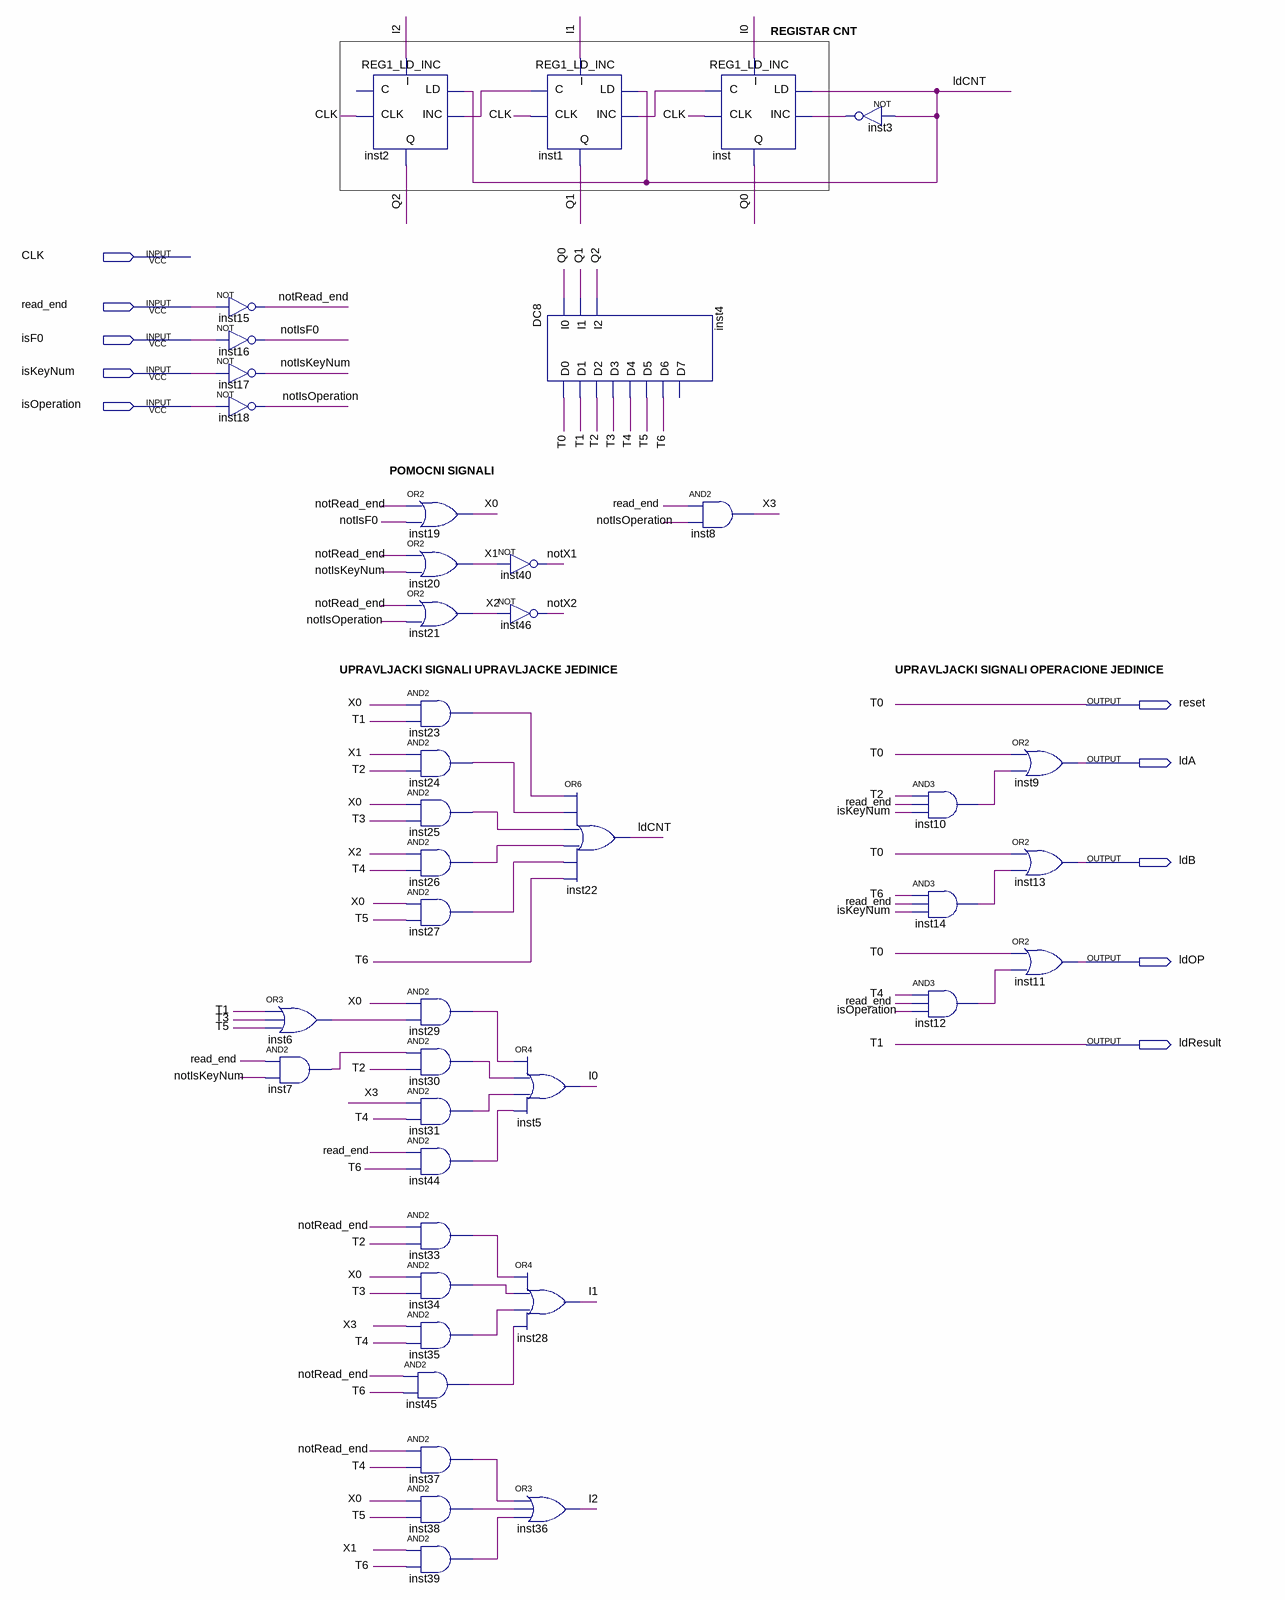
[diagram p0: schematic sheet]
// Quartus schematic UpravljackaJedinica_BrojacKoraka.bdf as structural Verilog: 43 symbols, 10 pins
module UpravljackaJedinica_BrojacKoraka (
  input  CLK,
  input  read_end,
  input  isF0,
  input  isKeyNum,
  input  isOperation,
  output reset,
  output ldA,
  output ldB,
  output ldOP,
  output ldResult
);

  wire I0, I1, I2, inst1_c, inst3_out, inst6_out, inst7_out, inst10_out, inst12_out, inst14_out, inst23_out,
       inst24_out, inst25_out, inst26_out, inst27_out, inst29_out, inst30_out, inst31_out, inst33_out,
       inst34_out, inst35_out, inst37_out, inst38_out, inst39_out, inst44_out, inst45_out, inst_c, ldCNT,
       notIsF0, notIsKeyNum, notIsOperation, notRead_end, notX1, notX2, Q0, Q1, Q2, T2, T3, T4, T5, T6, X0,
       X1, X2, X3;

  not inst15 (notRead_end, read_end);
  not inst16 (notIsF0, isF0);
  not inst17 (notIsKeyNum, isKeyNum);
  not inst18 (notIsOperation, isOperation);
  or inst6 (inst6_out, ldResult, T3, T5);
  and inst7 (inst7_out, read_end, notIsKeyNum);
  REG1_LD_INC inst2 (.I(I2), .LD(ldCNT), .INC(inst1_c), .CLK(CLK), .Q(Q2));  // open: C
  and inst45 (inst45_out, notRead_end, T6);
  or inst19 (X0, notRead_end, notIsF0);
  or inst20 (X1, notRead_end, notIsKeyNum);
  or inst21 (X2, notRead_end, notIsOperation);
  and inst23 (inst23_out, X0, ldResult);
  and inst24 (inst24_out, X1, T2);
  and inst25 (inst25_out, X0, T3);
  and inst26 (inst26_out, X2, T4);
  and inst27 (inst27_out, X0, T5);
  and inst29 (inst29_out, X0, inst6_out);
  and inst30 (inst30_out, inst7_out, T2);
  and inst31 (inst31_out, X3, T4);
  and inst44 (inst44_out, read_end, T6);
  and inst33 (inst33_out, notRead_end, T2);
  and inst34 (inst34_out, X0, T3);
  and inst35 (inst35_out, X3, T4);
  and inst37 (inst37_out, notRead_end, T4);
  and inst38 (inst38_out, X0, T5);
  and inst39 (inst39_out, X1, T6);
  REG1_LD_INC inst1 (.I(I1), .LD(ldCNT), .INC(inst_c), .CLK(CLK), .Q(Q1), .C(inst1_c));
  DC8 inst4 (
    .I0(Q0), .I1(Q1), .I2(Q2), .D0(reset), .D1(ldResult), .D2(T2), .D3(T3), .D4(T4), .D5(T5), .D6(T6));  // open: D7
  not inst40 (notX1, X1);
  not inst46 (notX2, X2);
  or inst5 (I0, inst29_out, inst30_out, inst31_out, inst44_out);
  or inst28 (I1, inst33_out, inst34_out, inst35_out, inst45_out);
  or inst36 (I2, inst37_out, inst38_out, inst39_out);
  or inst22 (ldCNT, inst23_out, inst24_out, inst25_out, inst26_out, inst27_out, T6);
  REG1_LD_INC inst (.I(I0), .LD(ldCNT), .INC(inst3_out), .CLK(CLK), .Q(Q0), .C(inst_c));
  and inst8 (X3, read_end, notIsOperation);
  not inst3 (inst3_out, ldCNT);
  and inst10 (inst10_out, T2, read_end, isKeyNum);
  and inst14 (inst14_out, T6, read_end, isKeyNum);
  and inst12 (inst12_out, T4, read_end, isOperation);
  or inst9 (ldA, reset, inst10_out);
  or inst13 (ldB, reset, inst14_out);
  or inst11 (ldOP, reset, inst12_out);

  // Other names for the same wires on the sheet: T0 = reset; T1 = ldResult

  // Notes on the sheet:
  //   REGISTAR CNT
  //   POMOCNI SIGNALI
  //   UPRAVLJACKI SIGNALI UPRAVLJACKE JEDINICE
  //   UPRAVLJACKI SIGNALI OPERACIONE JEDINICE
endmodule
